# Altium schematic sheet Sheet_1 copy copy.schdoc
size 589 x 414 mm; Device: A_A2; Symbol: A_A2; Name: A_A2; Designator: A; @Project Name: Sheet_1; REV: 1.0; Date: 2023-12-10; Sheet: 1/1; Draw By: sheep_finder; Company: Your Company; Manufacturer Part: ?; Convert to PCB: yes; Add into BOM: yes; Origin Footprint: NONE; Unique ID: frame_lib_1; SheetNumber: 1; SheetTotal: 2
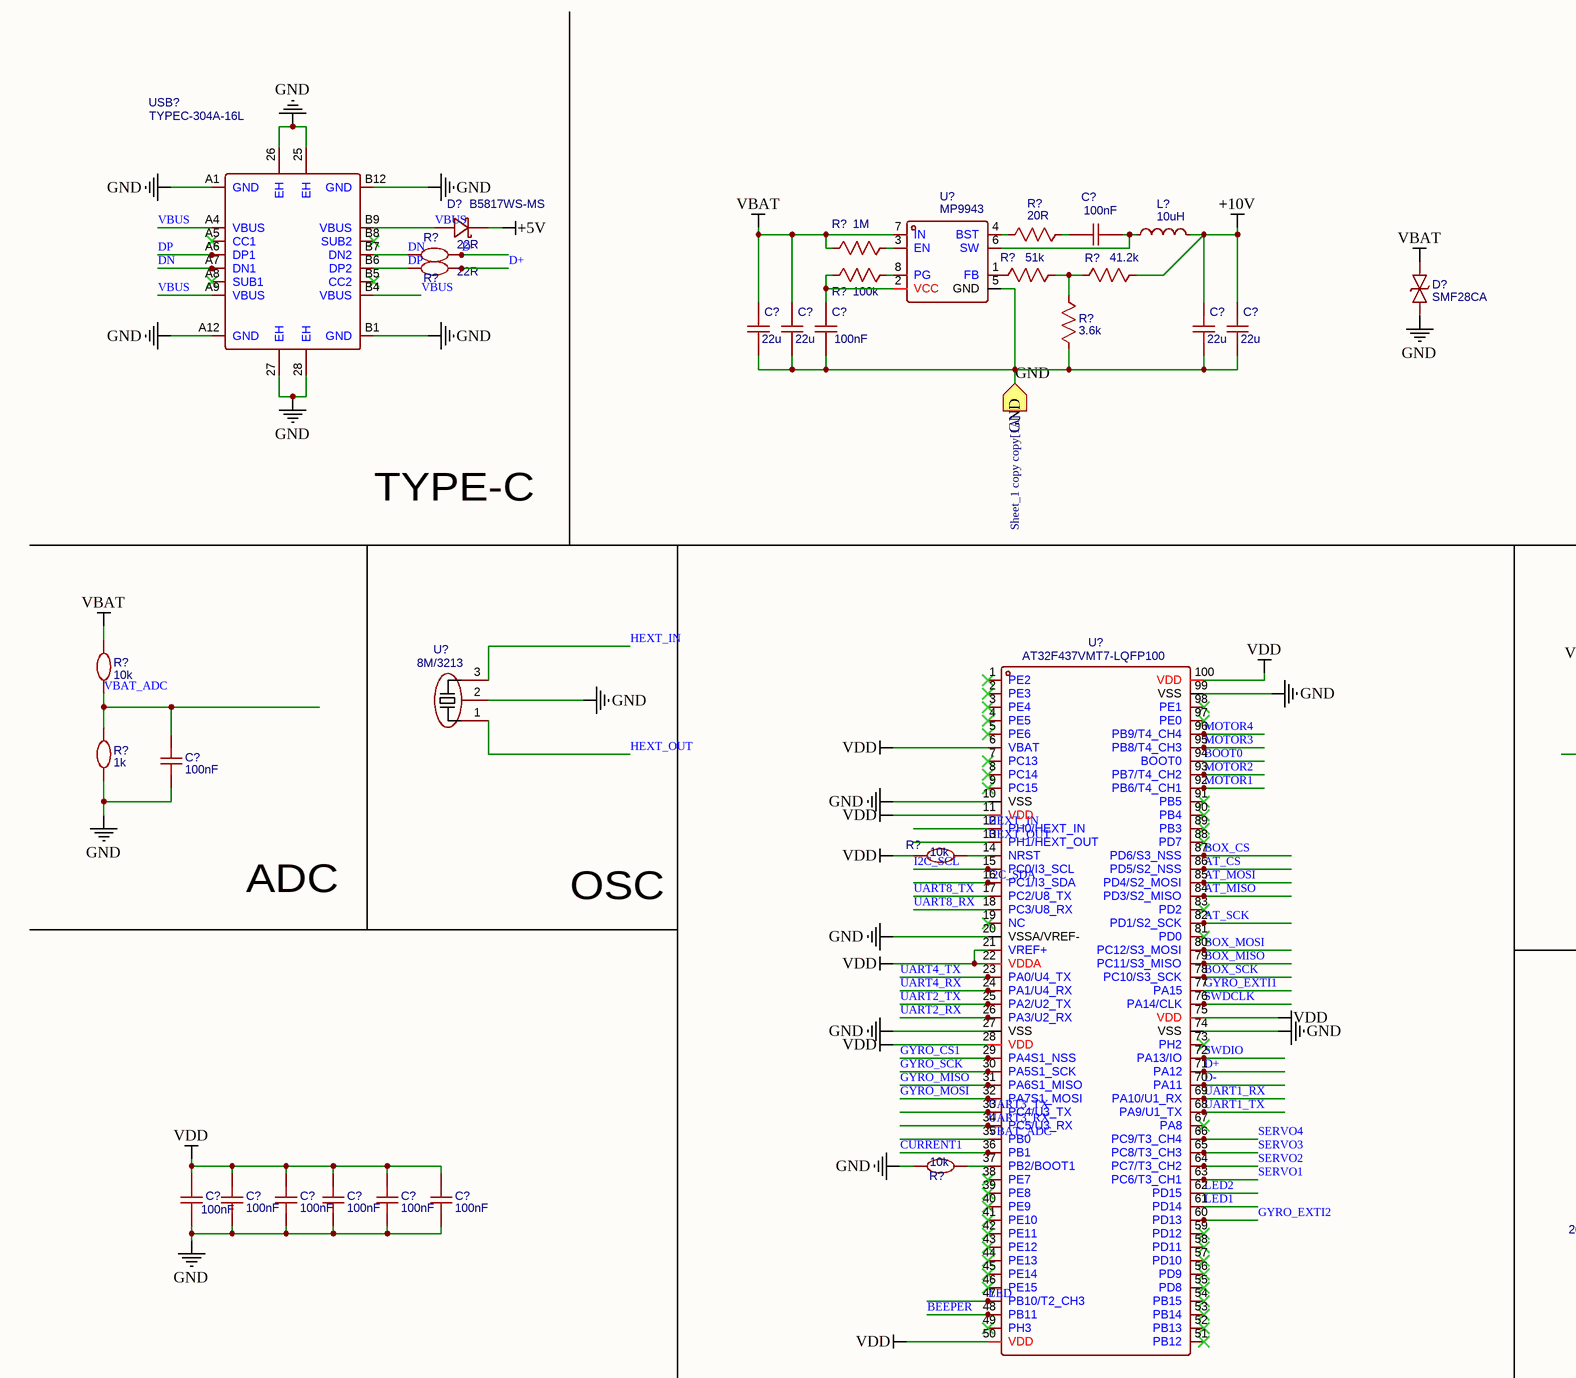
[diagram p0: Sheet_1 copy copy.schdoc, top left]
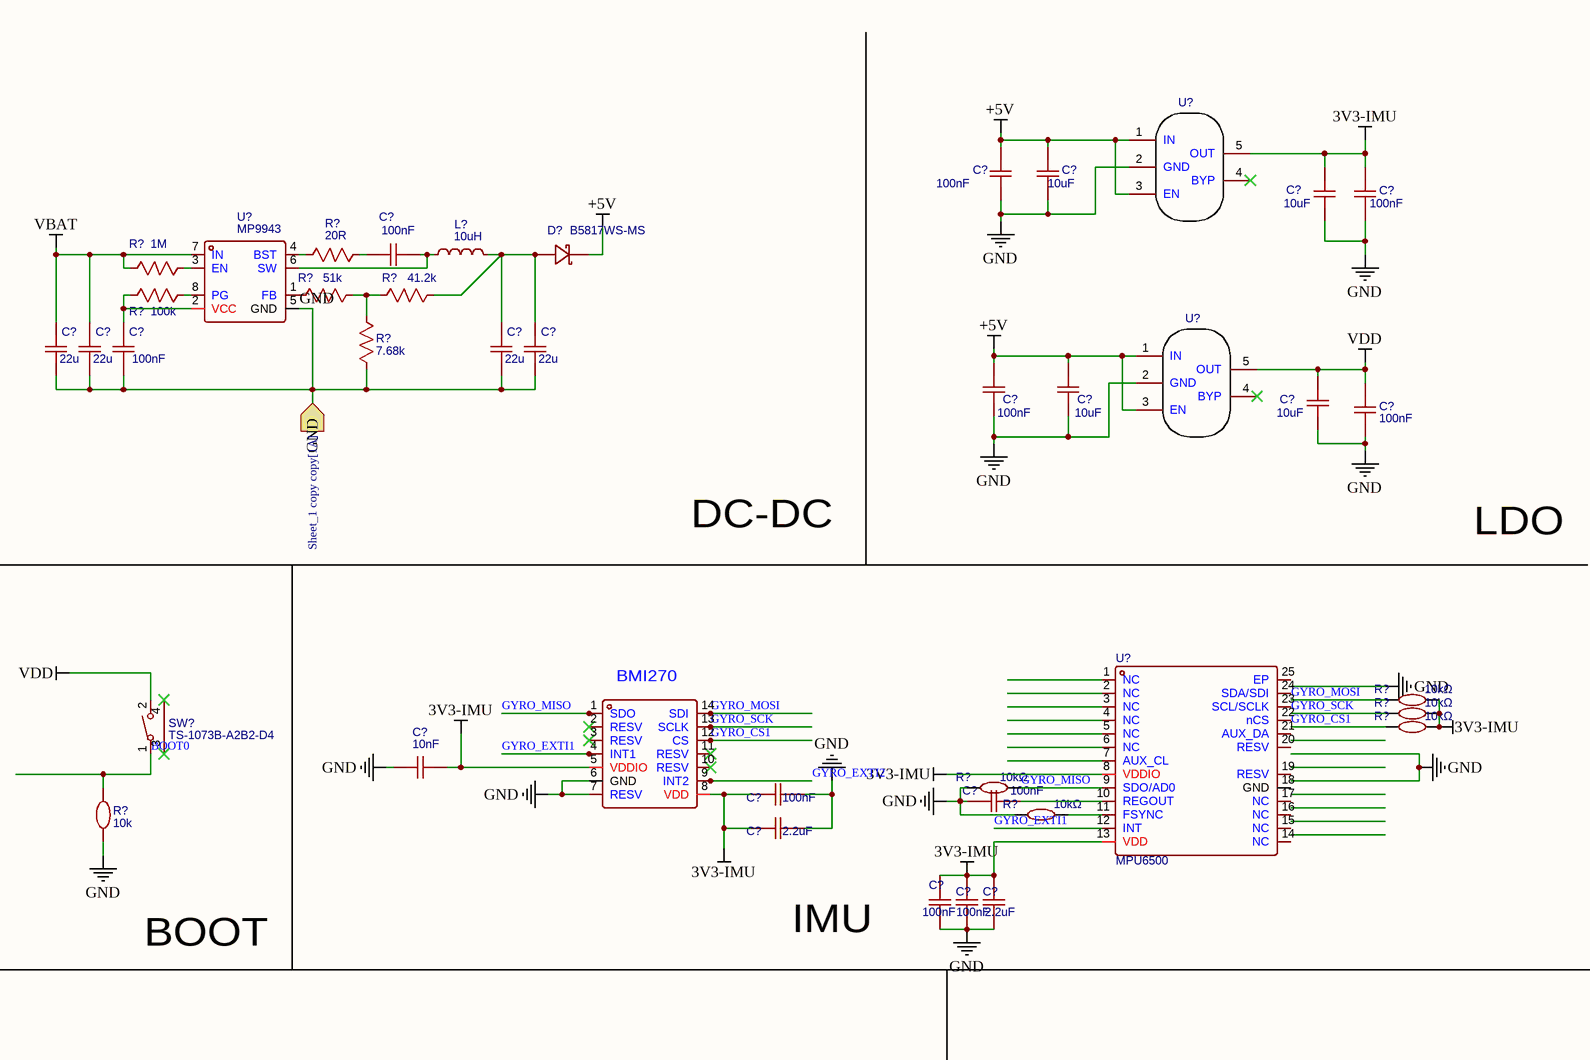
[diagram p1: Sheet_1 copy copy.schdoc, top right]
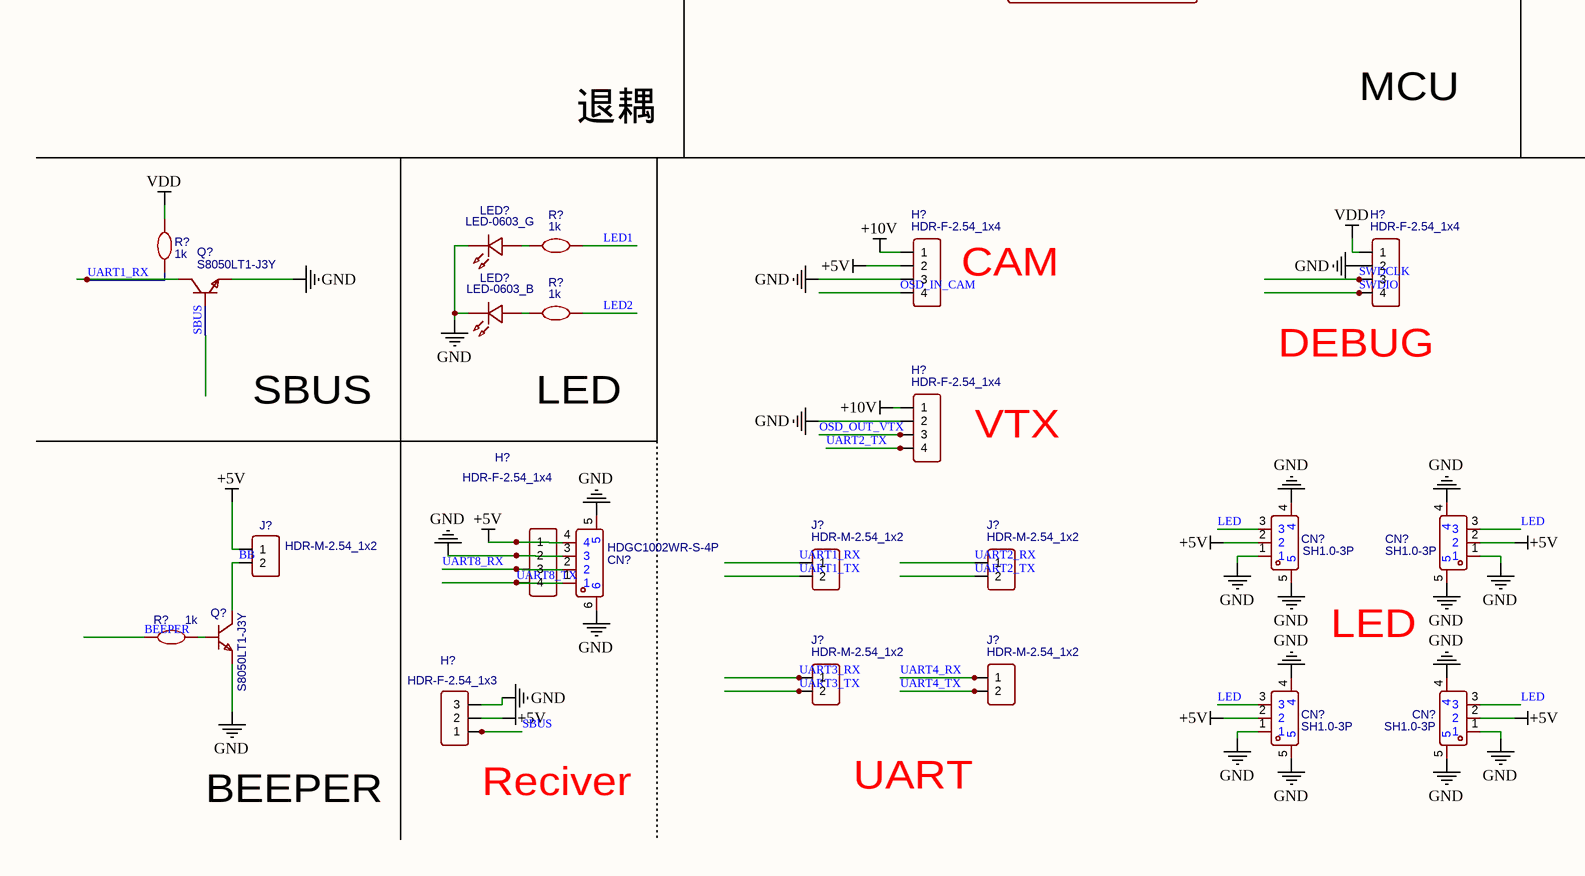
[diagram p2: Sheet_1 copy copy.schdoc, bottom left]
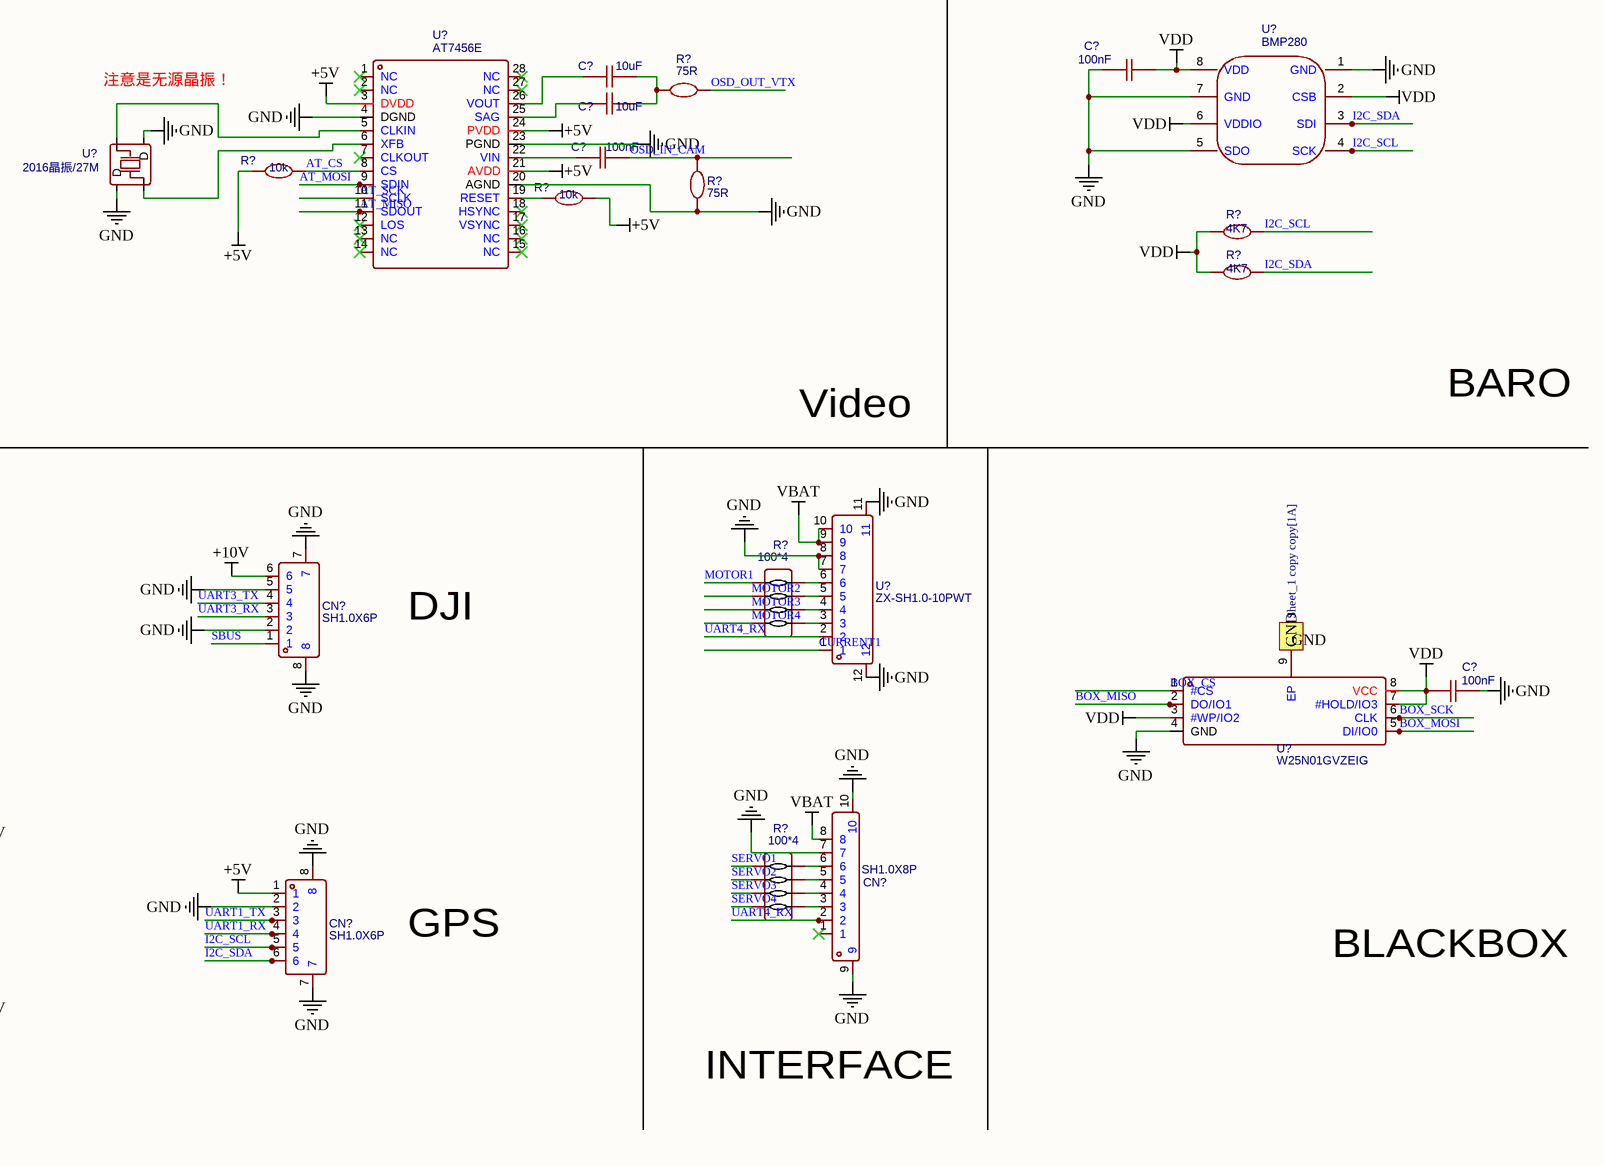
[diagram p3: Sheet_1 copy copy.schdoc, bottom right]

## Parts
(Parts that share a designator on the sheet are numbered #1, #2 ... from top to bottom, then left to right.)
C?#1  100nF  [C0603]
C?#2  10uF  [C0603]
C?#3  10uF  [C0603]
C?#4  100nF  [C0603]
C?#5  100nF  [C0603]
C?#6  100nF  [C0603]
C?#7  22u  [C0805]
C?#8  22u  [C0805]
C?#9  100nF  [C0603]
C?#10  22u  [C0805]
C?#11  22u  [C0805]
C?#12  22u  [C0805]
C?#13  22u  [C0805]
C?#14  100nF  [C0603]
C?#15  22u  [C0805]
C?#16  22u  [C0805]
C?#17  100nF  [C0603]
C?#18  10uF  [C0603]
C?#19  10uF  [C0603]
C?#20  100nF  [C0603]
C?#21  10nF  [C0603]
C?#22  100nF  [C0603]
C?#23  100nF  [C0603]
C?#24  100nF  [C0603]
C?#25  2.2uF  [C0603]
C?#26  100nF  [C0603]
C?#27  100nF  [C0603]
C?#28  2.2uF  [C0603]
C?#29  100nF  [C0603]
C?#30  10uF  [C0603]
C?#31  10uF  [C0603]
C?#32  100nF  [C0603]
C?#33  100nF  [C0603]
C?#34  100nF  [C0603]
C?#35  100nF  [C0603]
C?#36  100nF  [C0603]
C?#37  100nF  [C0603]
C?#38  100nF  [C0603]
C?#39  100nF  [C0603]
CN?#1  SH1.0X6P  [CONN-SMD_6P-P1.00_MEGASTAR_ZX-SH1.0-6PWT]
CN?#2  SH1.0-3P  [CONN-SMD_3P-P1.00_HDGC_HDGC1002WR-S-3P]
CN?#3  SH1.0-3P  [CONN-SMD_3P-P1.00_HDGC_HDGC1002WR-S-3P]
CN?#4  HDGC1002WR-S-4P  [CONN-SMD_4P-P1.00_HDGC_HDGC1002WR-S-4P]
CN?#5  SH1.0X8P  [CONN-SMD_8P-P1.00_WAFER-SH1.0-8PWB]
CN?#6  SH1.0X6P  [CONN-SMD_6P-P1.00_MEGASTAR_ZX-SH1.0-6PWT]
CN?#7  SH1.0-3P  [CONN-SMD_3P-P1.00_HDGC_HDGC1002WR-S-3P]
CN?#8  SH1.0-3P  [CONN-SMD_3P-P1.00_HDGC_HDGC1002WR-S-3P]
D?#1  B5817WS-MS  [SOD-323_L1.7-W1.3-LS2.7-FD]
D?#2  B5817WS-MS  [SOD-323_L1.7-W1.3-LS2.7-FD]
D?#3  SMF28CA  [SOD-123_L2.7-W1.8-LS3.7-BI]
H?#1  HDR-F-2.54_1x4
H?#2  HDR-F-2.54_1x4
H?#3  HDR-F-2.54_1x4
H?#4  HDR-F-2.54_1x4
H?#5  HDR-F-2.54_1x3
J?#1  HDR-M-2.54_1x2
J?#2  HDR-M-2.54_1x2
J?#3  HDR-M-2.54_1x2
J?#4  HDR-M-2.54_1x2
J?#5  HDR-M-2.54_1x2
L?#1  10uH  [IND-SMD_L4.4-W4.0_PHC0420]
L?#2  10uH  [IND-SMD_L4.4-W4.0_PHC0420]
LED?#1  LED-0603_G  [LED0603_GREEN]
LED?#2  LED-0603_B  [LED0603_BLUE]
Q?#1  S8050LT1-J3Y  [SOT-23_L2.9-W1.3-P1.90-LS2.4-BR]
Q?#2  S8050LT1-J3Y  [SOT-23_L2.9-W1.3-P1.90-LS2.4-BR]
R?#1  20R  [R0603]
R?#2  20R  [R0603]
R?#3  1M  [R0603]
R?#4  1M  [R0603]
R?#5  22R  [R0603]
R?#6  22R  [R0603]
R?#7  100k  [R0603]
R?#8  51k  [R0603]
R?#9  41.2k  [R0603]
R?#10  100k  [R0603]
R?#11  51k  [R0603]
R?#12  41.2k  [R0603]
R?#13  3.6k  [R0603]
R?#14  7.68k  [R0603]
R?#15  10k  [R0603]
R?#16  10kΩ  [R0402]
R?#17  10kΩ  [R0402]
R?#18  10kΩ  [R0402]
R?#19  1k  [R0603]
R?#20  10kΩ  [R0402]
R?#21  10k  [R0603]
R?#22  10kΩ  [R0402]
R?#23  10k  [R0603]
R?#24  75R  [R0603]
R?#25  10k  [R0603]
R?#26  10k  [R0603]
R?#27  75R  [R0603]
R?#28  10k  [R0603]
R?#29  4K7  [R0603]
R?#30  4K7  [R0603]
R?#31  1k  [R0603]
R?#32  1k  [R0603]
R?#33  1k  [R0603]
R?#34  100*4  [RES-ARRAY-SMD_0402-8P-L2.0-W1.0-BL]
R?#35  100*4  [RES-ARRAY-SMD_0402-8P-L2.0-W1.0-BL]
R?#36  1k  [R0603]
SDO?  BMI270  [LGA-14_L3.0-W2.5-P0.50-TL]  (value not drawn)
SW?  TS-1073B-A2B2-D4  [KEY-SMD_TS-1073B-A2B2-D4]
U?#1  SPX3819M5-L-3-3/TR  [SOT-23-5_L3.0-W1.7-P0.95-LS2.8-BL]  (value not drawn)
U?#2  MP9943  [QFN-8-3X3]
U?#3  MP9943  [QFN-8-3X3]
U?#4  SPX3819M5-L-3-3/TR  [SOT-23-5_L3.0-W1.7-P0.95-LS2.8-BL]  (value not drawn)
U?#5  8M/3213  [X3213]
U?#6  MPU6500  [QFN-24_L3.0-W3.0-P0.40-BL-EP]
U?#7  AT32F437VMT7-LQFP100  [LQFP-100_L14.0-W14.0-P0.50-LS16.0-TL]
U?#8  BMP280  [SENSOR-TH_BMP280-BL]
U?#9  2016晶振/27M  [2016晶振]
U?#10  AT7456E  [TSSOP-28_L9.7-W4.4-P0.65-LS6.4-BL-EP5.5]
U?#11  ZX-SH1.0-10PWT  [CONN-SMD_10P-P1.00_ZX-SH1.0-10PWT]
U?#12  W25N01GVZEIG  [WSON-8_L8.0-W6.10-P1.27-EP]
USB?  TYPEC-304A-16L  [USB-C-SMD_XUNPU_TYPEC-304A-ACP16L]

## Ports
GND (in, see Sheet_1 copy copy[1A])

## Nets
3V3-IMU: C?#3.2 C?#4.2 C?#21.2 C?#23.2 C?#25.2 C?#26.1 C?#27.1 C?#28.1 R?#16.2 R?#17.2 R?#18.2 SDO?.5(VDDIO) SDO?.8(VDD) U?#1.5(OUT) U?#6.8(VDDIO) U?#6.13(VDD)
+5V: C?#1.2 C?#2.2 C?#17.2 C?#18.2 CN?#2.2 CN?#3.2 CN?#4.4 CN?#6.1 CN?#7.2 CN?#8.2 D?#1.2(K) D?#2.2(K) H?#1.2 H?#4.1 H?#5.2 J?#1.1 R?#26.1 R?#28.2 U?#1.1(IN) U?#1.3(EN) U?#4.1(IN) U?#4.3(EN) U?#10.3(DVDD) U?#10.21(AVDD) U?#10.24(PVDD)
+10V: C?#10.2 C?#11.2 CN?#1.6 H?#1.1 H?#3.1 L?#1.2 R?#9.2
GND: C?#1.1 C?#2.1 C?#3.1 C?#4.1 C?#7.1 C?#8.1 C?#9.1 C?#10.1 C?#11.1 C?#12.1 C?#13.1 C?#14.1 C?#15.1 C?#16.1 C?#17.1 C?#18.1 C?#19.1 C?#20.1 C?#21.1 C?#22.1 C?#23.1 C?#24.1 C?#25.1 C?#26.2 C?#27.2 C?#28.2 C?#29.1 C?#32.1 C?#33.1 C?#34.1 C?#35.1 C?#36.1 C?#37.1 C?#39.2 CN?#1.2 CN?#1.5 CN?#1.7 CN?#1.8 CN?#2.1 CN?#2.4 CN?#2.5 CN?#3.1 CN?#3.4 CN?#3.5 CN?#4.3 CN?#4.5 CN?#4.6 CN?#5.7 CN?#5.9 CN?#5.10 CN?#6.2 CN?#6.7 CN?#6.8 CN?#7.1 CN?#7.4 CN?#7.5 CN?#8.1 CN?#8.4 CN?#8.5 D?#3.2 H?#1.3 H?#2.2 H?#3.2 H?#4.2 H?#5.3 LED?#1.2 LED?#2.2 Q?#1.2 Q?#2.2 R?#13.1 R?#14.1 R?#19.1 R?#20.1 R?#21.2 R?#22.1 R?#25.1 R?#27.1 SDO?.6(GND) SDO?.7(RESV) U?#1.2(GND) U?#2.5(GND) U?#3.5(GND) U?#4.2(GND) U?#5.2 U?#7.10(VSS) U?#7.20(VSSA/VREF-) U?#7.27(VSS) U?#7.74(VSS) U?#7.99(VSS) U?#8.1(GND) U?#8.5(SDO) U?#8.7(GND) U?#9.2(D) U?#9.4(D) U?#10.4(DGND) U?#10.20(AGND) U?#10.23(PGND) U?#11.7 U?#11.8 U?#11.11 U?#11.12 U?#12.4(GND) U?#12.9(EP) USB?.25(EH) USB?.26(EH) USB?.27(EH) USB?.28(EH) USB?.A1(GND) USB?.A12(GND) USB?.B1(GND) USB?.B12(GND) ; port GND
VBAT: C?#7.2 C?#8.2 C?#12.2 C?#13.2 CN?#5.8 D?#3.1 R?#3.2 R?#4.2 R?#15.2 U?#2.7(IN) U?#3.7(IN) U?#11.9 U?#11.10
VDD: C?#19.2 C?#20.2 C?#29.2 C?#32.2 C?#33.2 C?#34.2 C?#35.2 C?#36.2 C?#37.2 C?#39.1 H?#2.1 R?#23.2 R?#29.2 R?#30.2 R?#31.2 SW?.2 U?#4.5(OUT) U?#7.6(VBAT) U?#7.11(VDD) U?#7.21(VREF+) U?#7.22(VDDA) U?#7.28(VDD) U?#7.50(VDD) U?#7.75(VDD) U?#7.100(VDD) U?#8.2(CSB) U?#8.6(VDDIO) U?#8.8(VDD) U?#12.3(#WP/IO2) U?#12.7(#HOLD/IO3) U?#12.8(VCC)
AT_CS: R?#26.2 U?#7.86(PD5/S2_NSS) U?#10.8(CS)
AT_MISO: U?#7.84(PD3/S2_MISO) U?#10.11(SDOUT)
AT_MOSI: U?#7.85(PD4/S2_MOSI) U?#10.9(SDIN)
AT_SCK: U?#7.82(PD1/S2_SCK) U?#10.10(SCLK)
BB: J?#1.2 Q?#2.3
BEEPER: R?#36.1 U?#7.48(PB11)
BOOT0: R?#21.1 SW?.1 U?#7.94(BOOT0)
BOX_CS: U?#7.87(PD6/S3_NSS) U?#12.1(#CS)
BOX_MISO: U?#7.79(PC11/S3_MISO) U?#12.2(DO/IO1)
BOX_MOSI: U?#7.80(PC12/S3_MOSI) U?#12.5(DI/IO0)
BOX_SCK: U?#7.78(PC10/S3_SCK) U?#12.6(CLK)
CURRENT1: U?#7.36(PB1) U?#11.1
D+: R?#6.2 U?#7.71(PA12)
D-: R?#5.2 U?#7.70(PA11)
DN: R?#5.1 USB?.A7(DN1) USB?.B7(DN2)
DP: R?#6.1 USB?.A6(DP1) USB?.B6(DP2)
GYRO_CS1: R?#18.1 SDO?.12(CS) U?#7.29(PA4S1_NSS)
GYRO_EXTI1: SDO?.4(INT1) U?#6.12(INT) U?#7.77(PA15)
GYRO_EXTI2: SDO?.9(INT2) U?#7.60(PD13)
GYRO_MISO: R?#20.2 SDO?.1(SDO) U?#6.9(SDO/AD0) U?#7.31(PA6S1_MISO)
GYRO_MOSI: R?#16.1 SDO?.14(SDI) U?#7.32(PA7S1_MOSI)
GYRO_SCK: R?#17.1 SDO?.13(SCLK) U?#7.30(PA5S1_SCK)
HEXT_IN: U?#5.3 U?#7.12(PH0/HEXT_IN)
HEXT_OUT: U?#5.1 U?#7.13(PH1/HEXT_OUT)
I2C_SCL: CN?#6.5 R?#29.1 U?#7.15(PC0/I3_SCL) U?#8.4(SCK)
I2C_SDA: CN?#6.6 R?#30.1 U?#7.16(PC1/I3_SDA) U?#8.3(SDI)
LED: CN?#2.3 CN?#3.3 CN?#7.3 CN?#8.3 U?#7.47(PB10/T2_CH3)
LED1: R?#32.2 U?#7.61(PD14)
LED2: R?#33.2 U?#7.62(PD15)
MOTOR1: R?#34.4 U?#7.92(PB6/T4_CH1)
MOTOR2: R?#34.3 U?#7.93(PB7/T4_CH2)
MOTOR3: R?#34.2 U?#7.95(PB8/T4_CH3)
MOTOR4: R?#34.1 U?#7.96(PB9/T4_CH4)
OSD_IN_CAM: C?#38.2 H?#1.4 R?#27.2
OSD_OUT_VTX: H?#3.3 R?#24.2
SBUS: CN?#1.1 H?#5.1 Q?#1.1
SERVO1: R?#35.4 U?#7.63(PC6/T3_CH1)
SERVO2: R?#35.3 U?#7.64(PC7/T3_CH2)
SERVO3: R?#35.2 U?#7.65(PC8/T3_CH3)
SERVO4: R?#35.1 U?#7.66(PC9/T3_CH4)
SWDCLK: H?#2.3 U?#7.76(PA14/CLK)
SWDIO: H?#2.4 U?#7.72(PA13/IO)
UART1_RX: CN?#6.4 J?#2.1 Q?#1.3 R?#31.1 U?#7.69(PA10/U1_RX)
UART1_TX: CN?#6.3 J?#2.2 U?#7.68(PA9/U1_TX)
UART2_RX: J?#3.1 U?#7.26(PA3/U2_RX)
UART2_TX: H?#3.4 J?#3.2 U?#7.25(PA2/U2_TX)
UART3_RX: CN?#1.3 J?#4.1 U?#7.34(PC5/U3_RX)
UART3_TX: CN?#1.4 J?#4.2 U?#7.33(PC4/U3_TX)
UART4_RX: CN?#5.2 J?#5.1 U?#7.24(PA1/U4_RX) U?#11.2
UART4_TX: J?#5.2 U?#7.23(PA0/U4_TX)
UART8_RX: CN?#4.2 H?#4.3 U?#7.18(PC3/U8_RX)
UART8_TX: CN?#4.1 H?#4.4 U?#7.17(PC2/U8_TX)
VBAT_ADC: C?#22.2 R?#15.1 R?#19.2 U?#7.35(PB0)
VBUS: D?#1.1(A) USB?.A4(VBUS) USB?.A9(VBUS) USB?.B4(VBUS) USB?.B9(VBUS)
NetC?#5_1: C?#5.1 R?#1.2
NetC?#5_2: C?#5.2 L?#1.1 U?#2.6(SW)
NetC?#6_1: C?#6.1 R?#2.2
NetC?#6_2: C?#6.2 L?#2.1 U?#3.6(SW)
NetC?#9_2: C?#9.2 R?#7.1 U?#2.2(VCC)
NetC?#14_2: C?#14.2 R?#10.1 U?#3.2(VCC)
NetC?#15_2: C?#15.2 C?#16.2 D?#2.1(A) L?#2.2 R?#12.2
NetC?#24_2: C?#24.2 U?#6.10(REGOUT)
NetC?#30_1: C?#30.1 C?#31.1 R?#24.1
NetC?#30_2: C?#30.2 U?#10.26(VOUT)
NetC?#31_2: C?#31.2 U?#10.25(SAG)
NetC?#38_1: C?#38.1 U?#10.22(VIN)
NetCN?#5_3: CN?#5.3 R?#35.8
NetCN?#5_4: CN?#5.4 R?#35.7
NetCN?#5_5: CN?#5.5 R?#35.6
NetCN?#5_6: CN?#5.6 R?#35.5
NetLED?#1_1: LED?#1.1 R?#32.1
NetLED?#2_1: LED?#2.1 R?#33.1
NetQ?#2_1: Q?#2.1 R?#36.2
NetR?#1_1: R?#1.1 U?#2.4(BST)
NetR?#2_1: R?#2.1 U?#3.4(BST)
NetR?#3_1: R?#3.1 U?#2.3(EN)
NetR?#4_1: R?#4.1 U?#3.3(EN)
NetR?#7_2: R?#7.2 U?#2.8(PG)
NetR?#8_1: R?#8.1 U?#2.1(FB)
NetR?#8_2: R?#8.2 R?#9.1 R?#13.2
NetR?#10_2: R?#10.2 U?#3.8(PG)
NetR?#11_1: R?#11.1 U?#3.1(FB)
NetR?#11_2: R?#11.2 R?#12.1 R?#14.2
NetR?#22_2: R?#22.2 U?#6.11(FSYNC)
NetR?#23_1: R?#23.1 U?#7.14(NRST)
NetR?#25_2: R?#25.2 U?#7.37(PB2/BOOT1)
NetR?#28_1: R?#28.1 U?#10.19(RESET)
NetR?#34_5: R?#34.5 U?#11.6
NetR?#34_6: R?#34.6 U?#11.5
NetR?#34_7: R?#34.7 U?#11.4
NetR?#34_8: R?#34.8 U?#11.3
NetU?#9_1: U?#9.1(OSC1) U?#10.5(CLKIN)
NetU?#9_3: U?#9.3(OSC2) U?#10.6(XFB)

Not connected (* = marked no-connect by the designer): CN?#5 1*; SDO? 2(RESV)* 3(RESV)* 10(RESV)* 11(RESV)*; SW? 3* 4*; U?#1 4(BYP)*; U?#4 4(BYP)*; U?#6 1(NC) 2(NC) 3(NC) 4(NC) 5(NC) 6(NC) 7(AUX_CL) 14(NC) 15(NC) 16(NC) 17(NC) 18(GND) 19(RESV) 20(RESV) 21(AUX_DA) 22(nCS) 23(SCL/SCLK) 24(SDA/SDI) 25(EP); U?#7 1(PE2)* 2(PE3)* 3(PE4)* 4(PE5)* 5(PE6)* 7(PC13)* 8(PC14)* 9(PC15)* 19(NC)* 38(PE7)* 39(PE8)* 40(PE9)* 41(PE10)* 42(PE11)* 43(PE12)* 44(PE13)* 45(PE14)* 46(PE15)* 49(PH3)* 51(PB12)* 52(PB13)* 53(PB14)* 54(PB15)* 55(PD8)* 56(PD9)* 57(PD10)* 58(PD11)* 59(PD12)* 67(PA8)* 73(PH2)* 81(PD0)* 83(PD2)* 88(PD7)* 89(PB3)* 90(PB4)* 91(PB5)* 97(PE0)* 98(PE1)*; U?#10 1(NC)* 2(NC)* 7(CLKOUT)* 12(LOS)* 13(NC)* 14(NC)* 15(NC)* 16(NC)* 17(VSYNC)* 18(HSYNC)* 27(NC)* 28(NC)*; USB? A5(CC1)* A8(SUB1)* B5(CC2)* B8(SUB2)*

## Notes on the sheet
- TYPE-C
- DC-DC
- LDO
- (near SDO?) BMI270
- ADC
- OSC
- BOOT
- IMU
- 注意是无源晶振！
- 退耦
- MCU
- Video
- BARO
- (near H?#1) CAM
- DJI
- SBUS
- LED
- (near H?#2) DEBUG
- VTX
- (near CN?#2) LED
- GPS
- BLACKBOX
- BEEPER
- (near H?#5) Reciver
- UART
- INTERFACE
- 1
- 2
- 3
- 4
- 5
- 6
- 7
- 8
- 9
- 10
- 11
- A
- B
- C
- D
- E
- F
- G
- H
- TITLE:
- Sheet_1
- Company:
- Your Company
- Sheet:
- REV:
- 1.0
- 1/1
- Date:
- 2023-12-10
- Drawn By:
- sheep_finder

## Library data of the parts
C?#1 = 100nF: Convert to PCB: yes; UniqueId: ggeca7b0ddeeb75bee7; OriginModelName: C0603_L1.6-W0.8-H0.8; ModelTransform: 62.992,31.496,0,0,0,0,0,0,0; Device: 100nF; Add into BOM: yes; SymbolName: 100nF; FootprintName: C0603
C?#2 = 10uF: Convert to PCB: yes; UniqueId: gge5965a6e0a8e1c0df; OriginModelName: C0603_L1.6-W0.8-H0.8; ModelTransform: 62.992,31.496,0,0,0,0,0,0,0; Device: 10uF; Add into BOM: yes; SymbolName: 10uF; FootprintName: C0603
C?#3 = 10uF: Convert to PCB: yes; UniqueId: ggee7971eff1ce66244; OriginModelName: C0603_L1.6-W0.8-H0.8; ModelTransform: 62.992,31.496,0,0,0,0,0,0,0; Device: 10uF; Add into BOM: yes; SymbolName: 10uF; FootprintName: C0603
C?#4 = 100nF: Convert to PCB: yes; UniqueId: gge7ba523bb7e9eb41d; OriginModelName: C0603_L1.6-W0.8-H0.8; ModelTransform: 62.992,31.496,0,0,0,0,0,0,0; Device: 100nF; Add into BOM: yes; SymbolName: 100nF; FootprintName: C0603
C?#5 = 100nF: Convert to PCB: yes; UniqueId: gge52ce95ff5addf7c7; OriginModelName: C0603_L1.6-W0.8-H0.8; ModelTransform: 62.992,31.496,0,0,0,0,0,0,0; Device: 100nF; Add into BOM: yes; SymbolName: 100nF; FootprintName: C0603
C?#6 = 100nF: Convert to PCB: yes; UniqueId: ggecda314712177e332; OriginModelName: C0603_L1.6-W0.8-H0.8; ModelTransform: 62.992,31.496,0,0,0,0,0,0,0; Device: 100nF; Add into BOM: yes; SymbolName: 100nF; FootprintName: C0603
C?#7 = 22u: Convert to PCB: yes; UniqueId: gge353fd94c7c744818; OriginModelName: C0805_L2.0-W1.3-H1.3; ModelTransform: 78.74,51.181,0,0,0,0,0,0,0; Device: 22u; Add into BOM: yes; SymbolName: 22u; FootprintName: C0805
C?#8 = 22u: Convert to PCB: yes; UniqueId: gge3f3579b26317b48f; OriginModelName: C0805_L2.0-W1.3-H1.3; ModelTransform: 78.74,51.181,0,0,0,0,0,0,0; Device: 22u; Add into BOM: yes; SymbolName: 22u; FootprintName: C0805
C?#9 = 100nF: Convert to PCB: yes; UniqueId: gge6703928f547b0b14; OriginModelName: C0603_L1.6-W0.8-H0.8; ModelTransform: 62.992,31.496,0,0,0,0,0,0,0; Device: 100nF; Add into BOM: yes; SymbolName: 100nF; FootprintName: C0603
C?#10 = 22u: Convert to PCB: yes; UniqueId: ggea3c3f9500a281c6b; OriginModelName: C0805_L2.0-W1.3-H1.3; ModelTransform: 78.74,51.181,0,0,0,0,0,0,0; Device: 22u; Add into BOM: yes; SymbolName: 22u; FootprintName: C0805
C?#11 = 22u: Convert to PCB: yes; UniqueId: gge2484e21a77e28d03; OriginModelName: C0805_L2.0-W1.3-H1.3; ModelTransform: 78.74,51.181,0,0,0,0,0,0,0; Device: 22u; Add into BOM: yes; SymbolName: 22u; FootprintName: C0805
C?#12 = 22u: Convert to PCB: yes; UniqueId: gge7b8deaa52abeee98; OriginModelName: C0805_L2.0-W1.3-H1.3; ModelTransform: 78.74,51.181,0,0,0,0,0,0,0; Device: 22u; Add into BOM: yes; SymbolName: 22u; FootprintName: C0805
C?#13 = 22u: Convert to PCB: yes; UniqueId: gge0c0d9a2245dd9bee; OriginModelName: C0805_L2.0-W1.3-H1.3; ModelTransform: 78.74,51.181,0,0,0,0,0,0,0; Device: 22u; Add into BOM: yes; SymbolName: 22u; FootprintName: C0805
C?#14 = 100nF: Convert to PCB: yes; UniqueId: ggeb64b90ee87dd39cb; OriginModelName: C0603_L1.6-W0.8-H0.8; ModelTransform: 62.992,31.496,0,0,0,0,0,0,0; Device: 100nF; Add into BOM: yes; SymbolName: 100nF; FootprintName: C0603
C?#15 = 22u: Convert to PCB: yes; UniqueId: gge32340f00fe0e8bd0; OriginModelName: C0805_L2.0-W1.3-H1.3; ModelTransform: 78.74,51.181,0,0,0,0,0,0,0; Device: 22u; Add into BOM: yes; SymbolName: 22u; FootprintName: C0805
C?#16 = 22u: Convert to PCB: yes; UniqueId: ggee6eb9f67a65547cc; OriginModelName: C0805_L2.0-W1.3-H1.3; ModelTransform: 78.74,51.181,0,0,0,0,0,0,0; Device: 22u; Add into BOM: yes; SymbolName: 22u; FootprintName: C0805
C?#17 = 100nF: Convert to PCB: yes; UniqueId: ggea85fba6b31ef2400; OriginModelName: C0603_L1.6-W0.8-H0.8; ModelTransform: 62.992,31.496,0,0,0,0,0,0,0; Device: 100nF; Add into BOM: yes; SymbolName: 100nF; FootprintName: C0603
C?#18 = 10uF: Convert to PCB: yes; UniqueId: gge4c0cbcdc33413a46; OriginModelName: C0603_L1.6-W0.8-H0.8; ModelTransform: 62.992,31.496,0,0,0,0,0,0,0; Device: 10uF; Add into BOM: yes; SymbolName: 10uF; FootprintName: C0603
C?#19 = 10uF: Convert to PCB: yes; UniqueId: gge6e9699387ec808ae; OriginModelName: C0603_L1.6-W0.8-H0.8; ModelTransform: 62.992,31.496,0,0,0,0,0,0,0; Device: 10uF; Add into BOM: yes; SymbolName: 10uF; FootprintName: C0603
C?#20 = 100nF: Convert to PCB: yes; UniqueId: ggedb2a942aedfaf0e5; OriginModelName: C0603_L1.6-W0.8-H0.8; ModelTransform: 62.992,31.496,0,0,0,0,0,0,0; Device: 100nF; Add into BOM: yes; SymbolName: 100nF; FootprintName: C0603
C?#21 = 10nF: Convert to PCB: yes; UniqueId: ggecba86c4f4db73d07; OriginModelName: C0603_L1.6-W0.8-H0.8; ModelTransform: 62.992,31.496,0,0,0,0,0,0,0; Device: 10nF; Add into BOM: yes; SymbolName: 10nF; FootprintName: C0603
C?#22 = 100nF: Convert to PCB: yes; UniqueId: gged673bfa93339740f; OriginModelName: C0603_L1.6-W0.8-H0.8; ModelTransform: 62.992,31.496,0,0,0,0,0,0,0; Device: 100nF; Add into BOM: yes; SymbolName: 100nF; FootprintName: C0603
C?#23 = 100nF: Convert to PCB: yes; UniqueId: gge03e79812ca9f1594; OriginModelName: C0603_L1.6-W0.8-H0.8; ModelTransform: 62.992,31.496,0,0,0,0,0,0,0; Device: 100nF; Add into BOM: yes; SymbolName: 100nF; FootprintName: C0603
C?#24 = 100nF: Convert to PCB: yes; UniqueId: gge2b0adef4c2000f72; OriginModelName: C0603_L1.6-W0.8-H0.8; ModelTransform: 62.992,31.496,0,0,0,0,0,0,0; Device: 100nF; Add into BOM: yes; SymbolName: 100nF; FootprintName: C0603
C?#25 = 2.2uF: Convert to PCB: yes; UniqueId: gge194ad5a5974422c7; OriginModelName: C0603_L1.6-W0.8-H0.8; ModelTransform: 62.992,31.496,0,0,0,0,0,0,0; Device: 2.2uF; Add into BOM: yes; SymbolName: 2.2uF; FootprintName: C0603
C?#26 = 100nF: Convert to PCB: yes; UniqueId: gge1844c11426338be2; OriginModelName: C0603_L1.6-W0.8-H0.8; ModelTransform: 62.992,31.496,0,0,0,0,0,0,0; Device: 100nF; Add into BOM: yes; SymbolName: 100nF; FootprintName: C0603
C?#27 = 100nF: Convert to PCB: yes; UniqueId: ggefc1b89ea0528c883; OriginModelName: C0603_L1.6-W0.8-H0.8; ModelTransform: 62.992,31.496,0,0,0,0,0,0,0; Device: 100nF; Add into BOM: yes; SymbolName: 100nF; FootprintName: C0603
C?#28 = 2.2uF: Convert to PCB: yes; UniqueId: gge6b0287d4c016d85a; OriginModelName: C0603_L1.6-W0.8-H0.8; ModelTransform: 62.992,31.496,0,0,0,0,0,0,0; Device: 2.2uF; Add into BOM: yes; SymbolName: 2.2uF; FootprintName: C0603
C?#29 = 100nF: Convert to PCB: yes; UniqueId: ggec38fa6919078953f; OriginModelName: C0603_L1.6-W0.8-H0.8; ModelTransform: 62.992,31.496,0,0,0,0,0,0,0; Device: 100nF; Add into BOM: yes; SymbolName: 100nF; FootprintName: C0603
C?#30 = 10uF: Convert to PCB: yes; UniqueId: ggeeb9301ced7e232ca; OriginModelName: C0603_L1.6-W0.8-H0.8; ModelTransform: 62.992,31.496,0,0,0,0,0,0,0; Device: 10uF; Add into BOM: yes; SymbolName: 10uF; FootprintName: C0603
C?#31 = 10uF: Convert to PCB: yes; UniqueId: gge9a113f5a677df9d8; OriginModelName: C0603_L1.6-W0.8-H0.8; ModelTransform: 62.992,31.496,0,0,0,0,0,0,0; Device: 10uF; Add into BOM: yes; SymbolName: 10uF; FootprintName: C0603
C?#32 = 100nF: Convert to PCB: yes; UniqueId: ggef40206292685441e; OriginModelName: C0603_L1.6-W0.8-H0.8; ModelTransform: 62.992,31.496,0,0,0,0,0,0,0; Device: 100nF; Add into BOM: yes; SymbolName: 100nF; FootprintName: C0603
C?#33 = 100nF: Convert to PCB: yes; UniqueId: gge2ebcfc57574d399a; OriginModelName: C0603_L1.6-W0.8-H0.8; ModelTransform: 62.992,31.496,0,0,0,0,0,0,0; Device: 100nF; Add into BOM: yes; SymbolName: 100nF; FootprintName: C0603
C?#34 = 100nF: Convert to PCB: yes; UniqueId: gged33014bcecda883b; OriginModelName: C0603_L1.6-W0.8-H0.8; ModelTransform: 62.992,31.496,0,0,0,0,0,0,0; Device: 100nF; Add into BOM: yes; SymbolName: 100nF; FootprintName: C0603
C?#35 = 100nF: Convert to PCB: yes; UniqueId: ggee2bd2f168eb7a19f; OriginModelName: C0603_L1.6-W0.8-H0.8; ModelTransform: 62.992,31.496,0,0,0,0,0,0,0; Device: 100nF; Add into BOM: yes; SymbolName: 100nF; FootprintName: C0603
C?#36 = 100nF: Convert to PCB: yes; UniqueId: ggedee51cfaf3930afd; OriginModelName: C0603_L1.6-W0.8-H0.8; ModelTransform: 62.992,31.496,0,0,0,0,0,0,0; Device: 100nF; Add into BOM: yes; SymbolName: 100nF; FootprintName: C0603
C?#37 = 100nF: Convert to PCB: yes; UniqueId: gge26811f5395af21ce; OriginModelName: C0603_L1.6-W0.8-H0.8; ModelTransform: 62.992,31.496,0,0,0,0,0,0,0; Device: 100nF; Add into BOM: yes; SymbolName: 100nF; FootprintName: C0603
C?#38 = 100nF: Convert to PCB: yes; UniqueId: gge8daa5e5140b19545; OriginModelName: C0603_L1.6-W0.8-H0.8; ModelTransform: 62.992,31.496,0,0,0,0,0,0,0; Device: 100nF; Add into BOM: yes; SymbolName: 100nF; FootprintName: C0603
C?#39 = 100nF: Convert to PCB: yes; UniqueId: gge108316898df37a9f; OriginModelName: C0603_L1.6-W0.8-H0.8; ModelTransform: 62.992,31.496,0,0,0,0,0,0,0; Device: 100nF; Add into BOM: yes; SymbolName: 100nF; FootprintName: C0603
CN?#1 = ZX-SH1.0-6PWT: Manufacturer: Megastar(兆星); Convert to PCB: yes; UniqueId: ggecd9d3fcf4734ba22; ModelTransform: 329.1332,198.8185,0,0,0,0,0.002,-7.876,0; Device: ZX-SH1.0-6PWT; Supplier: LCSC; Supplier Part: C7430448; Manufacturer Part: ZX-SH1.0-6PWT; JLCPCB Part Class: Extended Part; link: https://so.szlcsc.com/global.html?k=C7430448&ref=editor; Add into BOM: yes; SymbolName: SH1.0X6P; FootprintName: CONN-SMD_6P-P1.00_MEGASTAR_ZX-SH1.0-6PWT; OriginModelName: CONN-SMD_6P-P1.00_MEGASTAR_ZX-SH1.0-6PWT
CN?#2 = HDGC1002WR-S-3P: Manufacturer: HDGC(华德共创); Convert to PCB: yes; UniqueId: ggec0020a35e89ad4ff; ModelTransform: 210.63,196.85,0,0,0,0,0,-9.565,0; Device: HDGC1002WR-S-3P; Supplier: LCSC; Supplier Part: C2936213; Manufacturer Part: HDGC1002WR-S-3P; JLCPCB Part Class: Extended Part; Add into BOM: yes; SymbolName: SH1.0-3P; FootprintName: CONN-SMD_3P-P1.00_HDGC_HDGC1002WR-S-3P; OriginModelName: CONN-SMD_3P-P1.00_HDGC_HDGC1002WR-S-3P
CN?#3 = HDGC1002WR-S-3P: Manufacturer: HDGC(华德共创); Convert to PCB: yes; UniqueId: gge2ce44b7eaad9832b; ModelTransform: 210.63,196.85,0,0,0,0,0,-9.565,0; Device: HDGC1002WR-S-3P; Supplier: LCSC; Supplier Part: C2936213; Manufacturer Part: HDGC1002WR-S-3P; JLCPCB Part Class: Extended Part; Add into BOM: yes; SymbolName: SH1.0-3P; FootprintName: CONN-SMD_3P-P1.00_HDGC_HDGC1002WR-S-3P; OriginModelName: CONN-SMD_3P-P1.00_HDGC_HDGC1002WR-S-3P
CN?#4 = HDGC1002WR-S-4P: Manufacturer: HDGC(华德共创); Convert to PCB: yes; UniqueId: ggee5a51ee7bd50bb1d; ModelTransform: 249.9995,196.85,0,0,0,0,0,-5.906,0; Device: HDGC1002WR-S-4P; Supplier: LCSC; Supplier Part: C2936214; Manufacturer Part: HDGC1002WR-S-4P; JLCPCB Part Class: Extended Part; Add into BOM: yes; SymbolName: HDGC1002WR-S-4P; FootprintName: CONN-SMD_4P-P1.00_HDGC_HDGC1002WR-S-4P; OriginModelName: CONN-SMD_4P-P1.00_HDGC_HDGC1002WR-S-4P
CN?#5 = WAFER_SMT_1.0X8: Manufacturer: null; Convert to PCB: yes; UniqueId: ggebe725300a9fc9f2b; ModelTransform: 407.873,198.8185,0,0,0,0,-0.001,-16.732,0; Device: WAFER_SMT_1.0X8; Supplier: LCSC; Supplier Part: C9900021939; Manufacturer Part: WAFER_SMT_1.0X8; JLCPCB Part Class: Extended Part; Add into BOM: yes; SymbolName: SH1.0X8P; FootprintName: CONN-SMD_8P-P1.00_WAFER-SH1.0-8PWB; OriginModelName: CONN-SMD_8P-P1.00_WAFER-SH1.0-8PWB
CN?#6 = ZX-SH1.0-6PWT: Manufacturer: Megastar(兆星); Convert to PCB: yes; UniqueId: gge7f46dd2bd5c42fec; ModelTransform: 329.1332,198.8185,0,0,0,0,0.002,-7.876,0; Device: ZX-SH1.0-6PWT; Supplier: LCSC; Supplier Part: C7430448; Manufacturer Part: ZX-SH1.0-6PWT; JLCPCB Part Class: Extended Part; link: https://so.szlcsc.com/global.html?k=C7430448&ref=editor; Add into BOM: yes; SymbolName: SH1.0X6P; FootprintName: CONN-SMD_6P-P1.00_MEGASTAR_ZX-SH1.0-6PWT; OriginModelName: CONN-SMD_6P-P1.00_MEGASTAR_ZX-SH1.0-6PWT
CN?#7 = HDGC1002WR-S-3P: Manufacturer: HDGC(华德共创); Convert to PCB: yes; UniqueId: gge5e0003f38aa131f5; ModelTransform: 210.63,196.85,0,0,0,0,0,-9.565,0; Device: HDGC1002WR-S-3P; Supplier: LCSC; Supplier Part: C2936213; Manufacturer Part: HDGC1002WR-S-3P; JLCPCB Part Class: Extended Part; Add into BOM: yes; SymbolName: SH1.0-3P; FootprintName: CONN-SMD_3P-P1.00_HDGC_HDGC1002WR-S-3P; OriginModelName: CONN-SMD_3P-P1.00_HDGC_HDGC1002WR-S-3P
CN?#8 = HDGC1002WR-S-3P: Manufacturer: HDGC(华德共创); Convert to PCB: yes; UniqueId: ggecca6adc977efc5d6; ModelTransform: 210.63,196.85,0,0,0,0,0,-9.565,0; Device: HDGC1002WR-S-3P; Supplier: LCSC; Supplier Part: C2936213; Manufacturer Part: HDGC1002WR-S-3P; JLCPCB Part Class: Extended Part; Add into BOM: yes; SymbolName: SH1.0-3P; FootprintName: CONN-SMD_3P-P1.00_HDGC_HDGC1002WR-S-3P; OriginModelName: CONN-SMD_3P-P1.00_HDGC_HDGC1002WR-S-3P
D?#1 = B5817WS-MS: Manufacturer: MSKSEMI(美森科); Convert to PCB: yes; UniqueId: gge7bf08ecfc7523faa; ModelTransform: 104.3305,51.181,0,0,0,0,0,0,0; Device: B5817WS-MS; Supplier: LCSC; Supplier Part: C2836388; Manufacturer Part: B5817WS-MS; JLCPCB Part Class: Extended Part; Add into BOM: yes; SymbolName: B5817WS-MS; FootprintName: SOD-323_L1.7-W1.3-LS2.7-FD; OriginModelName: SOD-323_L1.7-W1.3-LS2.7-FD
D?#2 = B5817WS-MS: Manufacturer: MSKSEMI(美森科); Convert to PCB: yes; UniqueId: gge33ebbc6fa40b7b0c; ModelTransform: 104.3305,51.181,0,0,0,0,0,0,0; Device: B5817WS-MS; Supplier: LCSC; Supplier Part: C2836388; Manufacturer Part: B5817WS-MS; JLCPCB Part Class: Extended Part; Add into BOM: yes; SymbolName: B5817WS-MS; FootprintName: SOD-323_L1.7-W1.3-LS2.7-FD; OriginModelName: SOD-323_L1.7-W1.3-LS2.7-FD
D?#3 = SMF28CA: Manufacturer: AnBon(安邦); Convert to PCB: yes; UniqueId: gge8336ca0810bb463b; ModelTransform: 145.669,70.866,0,0,0,0,0,0,0; Device: SMF28CA; Supplier: LCSC; Supplier Part: C435496; Manufacturer Part: SMF28CA; JLCPCB Part Class: Extended Part; link: https://so.szlcsc.com/global.html?k=C435496&ref=editor; Add into BOM: yes; SymbolName: SMF28CA; FootprintName: SOD-123_L2.7-W1.8-LS3.7-BI; OriginModelName: SOD-123_L2.7-W1.8-LS3.7-BI
H?#1 = HDR-F-2.54_1x4: Convert to PCB: no; UniqueId: gge885eefff489981f5; Device: HDR-F-2.54_1x4; Supplier Part: C225501; Supplier: LCSC; Add into BOM: no; Origin Footprint: HDR-F-2.54_1X4; SymbolName: HDR-F-2.54_1x4
H?#2 = HDR-F-2.54_1x4: Convert to PCB: no; UniqueId: ggeb577fd7058a0a445; Device: HDR-F-2.54_1x4; Supplier Part: C225501; Supplier: LCSC; Add into BOM: no; Origin Footprint: HDR-F-2.54_1X4; SymbolName: HDR-F-2.54_1x4
H?#3 = HDR-F-2.54_1x4: Convert to PCB: no; UniqueId: ggeb2604217fb50aa1f; Device: HDR-F-2.54_1x4; Supplier Part: C225501; Supplier: LCSC; Add into BOM: no; Origin Footprint: HDR-F-2.54_1X4; SymbolName: HDR-F-2.54_1x4
H?#4 = HDR-F-2.54_1x4: Convert to PCB: no; UniqueId: ggee6be973db10bda17; Device: HDR-F-2.54_1x4; Supplier Part: C225501; Supplier: LCSC; Add into BOM: no; Origin Footprint: HDR-F-2.54_1X4; SymbolName: HDR-F-2.54_1x4
H?#5 = HDR-F-2.54_1x3: Convert to PCB: no; UniqueId: ggeb90c589a3958aeec; Device: HDR-F-2.54_1x3; Supplier Part: C146690; Supplier: LCSC; Add into BOM: no; Origin Footprint: HDR-F-2.54_1X3; SymbolName: HDR-F-2.54_1x3
J?#1 = HDR-M-2.54_1x2: Convert to PCB: no; UniqueId: gge45273bc977e0dc7f; Device: HDR-M-2.54_1x2; Supplier Part: C124375; Supplier: LCSC; Add into BOM: no; Origin Footprint: HDR-M-2.54_1X2; SymbolName: HDR-M-2.54_1x2
J?#2 = HDR-M-2.54_1x2: Convert to PCB: no; UniqueId: gge12fcbeb4db2ab241; Device: HDR-M-2.54_1x2; Supplier Part: C124375; Supplier: LCSC; Add into BOM: no; Origin Footprint: HDR-M-2.54_1X2; SymbolName: HDR-M-2.54_1x2
J?#3 = HDR-M-2.54_1x2: Convert to PCB: no; UniqueId: gge368a583462a7af64; Device: HDR-M-2.54_1x2; Supplier Part: C124375; Supplier: LCSC; Add into BOM: no; Origin Footprint: HDR-M-2.54_1X2; SymbolName: HDR-M-2.54_1x2
J?#4 = HDR-M-2.54_1x2: Convert to PCB: no; UniqueId: gge86939b4fd004270e; Device: HDR-M-2.54_1x2; Supplier Part: C124375; Supplier: LCSC; Add into BOM: no; Origin Footprint: HDR-M-2.54_1X2; SymbolName: HDR-M-2.54_1x2
J?#5 = HDR-M-2.54_1x2: Convert to PCB: no; UniqueId: gge963c905d1ba80b10; Device: HDR-M-2.54_1x2; Supplier Part: C124375; Supplier: LCSC; Add into BOM: no; Origin Footprint: HDR-M-2.54_1X2; SymbolName: HDR-M-2.54_1x2
L?#1 = PHC0420-100M-T: Manufacturer: EMTEK; Convert to PCB: yes; UniqueId: gge99af4ca34bfde78c; OriginModelName: IND-SMD_L4.4-W4.0-H1.2_PHC0420; ModelTransform: 175.1965,159.842,0,0,0,0,0,0,0; Device: PHC0420-100M-T; Supplier: LCSC; Supplier Part: C251694; Manufacturer Part: PHC0420-100M-T; Add into BOM: yes; SymbolName: 10uH; FootprintName: IND-SMD_L4.4-W4.0_PHC0420
L?#2 = PHC0420-100M-T: Manufacturer: EMTEK; Convert to PCB: yes; UniqueId: gge7b26eb143931701e; OriginModelName: IND-SMD_L4.4-W4.0-H1.2_PHC0420; ModelTransform: 175.1965,159.842,0,0,0,0,0,0,0; Device: PHC0420-100M-T; Supplier: LCSC; Supplier Part: C251694; Manufacturer Part: PHC0420-100M-T; Add into BOM: yes; SymbolName: 10uH; FootprintName: IND-SMD_L4.4-W4.0_PHC0420
LED?#1 = 19-217/GHC-YR1S2/3T: Manufacturer: EVERLIGHT(台湾亿光); Convert to PCB: yes; UniqueId: ggec33a0d43bf0fd1a5; OriginModelName: LED0603-RD_GREEN; ModelTransform: 63.7794,31.496,0,0,0,0,0,0,0; Device: 19-217/GHC-YR1S2/3T; Manufacturer Part: 19-217/GHC-YR1S2/3T; Supplier Part: C72043; Supplier: LCSC; Add into BOM: yes; SymbolName: LED-0603_G; FootprintName: LED0603_GREEN
LED?#2 = 19-217/BHC-ZL1M2RY/3T: Manufacturer: EVERLIGHT(台湾亿光); Convert to PCB: yes; UniqueId: gge88f0d97242bbc373; ModelTransform: 63.07074,31.57474,0,180,0,0,0,0,0; Device: 19-217/BHC-ZL1M2RY/3T; Manufacturer Part: 19-217/BHC-ZL1M2RY/3T; Supplier Part: C72041; Supplier: LCSC; Add into BOM: yes; SymbolName: LED-0603_B; FootprintName: LED0603_BLUE; OriginModelName: LED0603_BLUE
Q?#1 = S8050LT1-J3Y: Manufacturer: FH(风华); Convert to PCB: yes; UniqueId: gge1c8eb3e3ebf663b6; OriginModelName: SOT-23-3P_L2.9-W1.3-H1.0-LS2.4-P0.95; ModelTransform: 98.64468,114.173,0,180,0,0,0.001,0.001,0; Device: S8050LT1-J3Y; Supplier: LCSC; Supplier Part: C2962087; Manufacturer Part: S8050LT1-J3Y; link: https://atta.szlcsc.com/upload/public/pdf/source/20220411/740B3F4857AB400E9826209E74F1EDA4.pdf; Add into BOM: yes; SymbolName: S8050LT1-J3Y; FootprintName: SOT-23_L2.9-W1.3-P1.90-LS2.4-BR
Q?#2 = S8050LT1-J3Y: Manufacturer: FH(风华); Convert to PCB: yes; UniqueId: gge7f16b287a280f568; OriginModelName: SOT-23-3P_L2.9-W1.3-H1.0-LS2.4-P0.95; ModelTransform: 98.64468,114.173,0,180,0,0,0.001,0.001,0; Device: S8050LT1-J3Y; Supplier: LCSC; Supplier Part: C2962087; Manufacturer Part: S8050LT1-J3Y; link: https://atta.szlcsc.com/upload/public/pdf/source/20220411/740B3F4857AB400E9826209E74F1EDA4.pdf; Add into BOM: yes; SymbolName: S8050LT1-J3Y; FootprintName: SOT-23_L2.9-W1.3-P1.90-LS2.4-BR
R?#1 = 20R: Convert to PCB: yes; UniqueId: gge2803cdfef027f426; ModelTransform: 31.8897,63.7794,0,90,0,0,0,0,0; Device: 20R; Add into BOM: yes; SymbolName: 20R; FootprintName: R0603; OriginModelName: R0603
R?#2 = 20R: Convert to PCB: yes; UniqueId: ggeae51583009f5c62d; ModelTransform: 31.8897,63.7794,0,90,0,0,0,0,0; Device: 20R; Add into BOM: yes; SymbolName: 20R; FootprintName: R0603; OriginModelName: R0603
R?#3 = 1M: Convert to PCB: yes; UniqueId: gge718708ee9e31e9c6; ModelTransform: 31.8897,63.7794,0,90,0,0,0,0,0; Device: 1M; Add into BOM: yes; SymbolName: 1M; FootprintName: R0603; OriginModelName: R0603
R?#4 = 1M: Convert to PCB: yes; UniqueId: ggee74e946aa43fe3b1; ModelTransform: 31.8897,63.7794,0,90,0,0,0,0,0; Device: 1M; Add into BOM: yes; SymbolName: 1M; FootprintName: R0603; OriginModelName: R0603
R?#5 = 22R: Convert to PCB: yes; UniqueId: gge1054e90f8c2270dd; ModelTransform: 31.8897,63.7794,0,90,0,0,0,0,0; Device: 22R; Add into BOM: yes; SymbolName: 22R; FootprintName: R0603; OriginModelName: R0603
R?#6 = 22R: Convert to PCB: yes; UniqueId: gge376c1236b153a772; ModelTransform: 31.8897,63.7794,0,90,0,0,0,0,0; Device: 22R; Add into BOM: yes; SymbolName: 22R; FootprintName: R0603; OriginModelName: R0603
R?#7 = 100k: Convert to PCB: yes; UniqueId: gge65a4b7670a104600; ModelTransform: 31.8897,63.7794,0,90,0,0,0,0,0; Device: 100k; Add into BOM: yes; SymbolName: 100k; FootprintName: R0603; OriginModelName: R0603
R?#8 = 51k: Convert to PCB: yes; UniqueId: gge9fd81eef2a8f7ffa; ModelTransform: 31.8897,63.7794,0,90,0,0,0,0,0; Device: 51k; Add into BOM: yes; SymbolName: 51k; FootprintName: R0603; OriginModelName: R0603
R?#9 = 41.2k: Convert to PCB: yes; UniqueId: gge9f85a8b729309dec; ModelTransform: 31.8897,63.7794,0,90,0,0,0,0,0; Device: 41.2k; Add into BOM: yes; SymbolName: 41.2k; FootprintName: R0603; OriginModelName: R0603
R?#10 = 100k: Convert to PCB: yes; UniqueId: gge19e236c747ebd94a; ModelTransform: 31.8897,63.7794,0,90,0,0,0,0,0; Device: 100k; Add into BOM: yes; SymbolName: 100k; FootprintName: R0603; OriginModelName: R0603
R?#11 = 51k: Convert to PCB: yes; UniqueId: gge0f1b7351eff14f5c; ModelTransform: 31.8897,63.7794,0,90,0,0,0,0,0; Device: 51k; Add into BOM: yes; SymbolName: 51k; FootprintName: R0603; OriginModelName: R0603
R?#12 = 41.2k: Convert to PCB: yes; UniqueId: ggeaf2d57fb3ee954de; ModelTransform: 31.8897,63.7794,0,90,0,0,0,0,0; Device: 41.2k; Add into BOM: yes; SymbolName: 41.2k; FootprintName: R0603; OriginModelName: R0603
R?#13 = 3.6k: Convert to PCB: yes; UniqueId: gge2804a892dc8b5d22; ModelTransform: 31.8897,63.7794,0,90,0,0,0,0,0; Device: 3.6k; Add into BOM: yes; SymbolName: 3.6k; FootprintName: R0603; OriginModelName: R0603
R?#14 = 7.68k: Convert to PCB: yes; UniqueId: gge438bc0fbe55c7c82; ModelTransform: 31.8897,63.7794,0,90,0,0,0,0,0; Device: 7.68k; Add into BOM: yes; SymbolName: 7.68k; FootprintName: R0603; OriginModelName: R0603
R?#15 = 10k: Convert to PCB: yes; UniqueId: ggeb37841dcc2a40db6; ModelTransform: 31.8897,63.7794,0,90,0,0,0,0,0; Device: 10k; Add into BOM: yes; SymbolName: 10k; FootprintName: R0603; OriginModelName: R0603
R?#16 = RC0402FR-0710KL: Manufacturer: YAGEO(国巨); Convert to PCB: yes; UniqueId: gge03b7dc052d3712c7; OriginModelName: R0402_L1.0-W0.5-H0.4; ModelTransform: 39.37,19.685,0,0,0,0,0,0.001,0; Device: RC0402FR-0710KL; Supplier: LCSC; Manufacturer Part: RC0402FR-0710KL; Supplier Part: C60490; JLCPCB Part Class: Extended Part; Add into BOM: yes; SymbolName: 10kΩ; FootprintName: R0402
R?#17 = RC0402FR-0710KL: Manufacturer: YAGEO(国巨); Convert to PCB: yes; UniqueId: gge0e8147650a4c1f88; OriginModelName: R0402_L1.0-W0.5-H0.4; ModelTransform: 39.37,19.685,0,0,0,0,0,0.001,0; Device: RC0402FR-0710KL; Supplier: LCSC; Manufacturer Part: RC0402FR-0710KL; Supplier Part: C60490; JLCPCB Part Class: Extended Part; Add into BOM: yes; SymbolName: 10kΩ; FootprintName: R0402
R?#18 = RC0402FR-0710KL: Manufacturer: YAGEO(国巨); Convert to PCB: yes; UniqueId: gge4607301ef64e3a36; OriginModelName: R0402_L1.0-W0.5-H0.4; ModelTransform: 39.37,19.685,0,0,0,0,0,0.001,0; Device: RC0402FR-0710KL; Supplier: LCSC; Manufacturer Part: RC0402FR-0710KL; Supplier Part: C60490; JLCPCB Part Class: Extended Part; Add into BOM: yes; SymbolName: 10kΩ; FootprintName: R0402
R?#19 = 1k: Convert to PCB: yes; UniqueId: gge14669116017803cb; ModelTransform: 31.8897,63.7794,0,90,0,0,0,0,0; Device: 1k; Add into BOM: yes; SymbolName: 1k; FootprintName: R0603; OriginModelName: R0603
R?#20 = RC0402FR-0710KL: Manufacturer: YAGEO(国巨); Convert to PCB: yes; UniqueId: ggeb12758e104cafe18; OriginModelName: R0402_L1.0-W0.5-H0.4; ModelTransform: 39.37,19.685,0,0,0,0,0,0.001,0; Device: RC0402FR-0710KL; Supplier: LCSC; Manufacturer Part: RC0402FR-0710KL; Supplier Part: C60490; JLCPCB Part Class: Extended Part; Add into BOM: yes; SymbolName: 10kΩ; FootprintName: R0402
R?#21 = 10k: Convert to PCB: yes; UniqueId: ggecda1f708b81c7ca6; ModelTransform: 31.8897,63.7794,0,90,0,0,0,0,0; Device: 10k; Add into BOM: yes; SymbolName: 10k; FootprintName: R0603; OriginModelName: R0603
R?#22 = RC0402FR-0710KL: Manufacturer: YAGEO(国巨); Convert to PCB: yes; UniqueId: ggefd6f330f786ae1bc; OriginModelName: R0402_L1.0-W0.5-H0.4; ModelTransform: 39.37,19.685,0,0,0,0,0,0.001,0; Device: RC0402FR-0710KL; Supplier: LCSC; Manufacturer Part: RC0402FR-0710KL; Supplier Part: C60490; JLCPCB Part Class: Extended Part; Add into BOM: yes; SymbolName: 10kΩ; FootprintName: R0402
R?#23 = 10k: Convert to PCB: yes; UniqueId: gge74c37a84cb754f85; ModelTransform: 31.8897,63.7794,0,90,0,0,0,0,0; Device: 10k; Add into BOM: yes; SymbolName: 10k; FootprintName: R0603; OriginModelName: R0603
R?#24 = 75R: Convert to PCB: yes; UniqueId: gge99ad03ce5fc1563c; ModelTransform: 31.8897,63.7794,0,90,0,0,0,0,0; Device: 75R; Add into BOM: yes; SymbolName: 75R; FootprintName: R0603; OriginModelName: R0603
R?#25 = 10k: Convert to PCB: yes; UniqueId: ggecccef22c02713413; ModelTransform: 31.8897,63.7794,0,90,0,0,0,0,0; Device: 10k; Add into BOM: yes; SymbolName: 10k; FootprintName: R0603; OriginModelName: R0603
R?#26 = 10k: Convert to PCB: yes; UniqueId: ggecb38663ade157f52; ModelTransform: 31.8897,63.7794,0,90,0,0,0,0,0; Device: 10k; Add into BOM: yes; SymbolName: 10k; FootprintName: R0603; OriginModelName: R0603
R?#27 = 75R: Convert to PCB: yes; UniqueId: gge175528db6f6a6a66; ModelTransform: 31.8897,63.7794,0,90,0,0,0,0,0; Device: 75R; Add into BOM: yes; SymbolName: 75R; FootprintName: R0603; OriginModelName: R0603
R?#28 = 10k: Convert to PCB: yes; UniqueId: ggee41f9b045fab3390; ModelTransform: 31.8897,63.7794,0,90,0,0,0,0,0; Device: 10k; Add into BOM: yes; SymbolName: 10k; FootprintName: R0603; OriginModelName: R0603
R?#29 = 4K7: Convert to PCB: yes; UniqueId: gge096ca4e081fb04e8; ModelTransform: 31.8897,63.7794,0,90,0,0,0,0,0; Device: 4K7; Add into BOM: yes; SymbolName: 4K7; FootprintName: R0603; OriginModelName: R0603
R?#30 = 4K7: Convert to PCB: yes; UniqueId: gge5e765753ece9e3c8; ModelTransform: 31.8897,63.7794,0,90,0,0,0,0,0; Device: 4K7; Add into BOM: yes; SymbolName: 4K7; FootprintName: R0603; OriginModelName: R0603
R?#31 = 1k: Convert to PCB: yes; UniqueId: ggee0760564004a1d0b; ModelTransform: 31.8897,63.7794,0,90,0,0,0,0,0; Device: 1k; Add into BOM: yes; SymbolName: 1k; FootprintName: R0603; OriginModelName: R0603
R?#32 = 1k: Convert to PCB: yes; UniqueId: ggebc1ed0bbe25fab2f; ModelTransform: 31.8897,63.7794,0,90,0,0,0,0,0; Device: 1k; Add into BOM: yes; SymbolName: 1k; FootprintName: R0603; OriginModelName: R0603
R?#33 = 1k: Convert to PCB: yes; UniqueId: ggee94924af568416b5; ModelTransform: 31.8897,63.7794,0,90,0,0,0,0,0; Device: 1k; Add into BOM: yes; SymbolName: 1k; FootprintName: R0603; OriginModelName: R0603
R?#34 = 4D02WGF1002TCE: Manufacturer: UNI-ROYAL(厚声); Convert to PCB: yes; UniqueId: gge07544b47d1892801; OriginModelName: R0402-8P_L2.0-W1.0-H0.5; ModelTransform: 78.74,39.37,0,180,0,0,0,0,0; Device: 4D02WGF1002TCE; Supplier: LCSC; Supplier Part: C414600; Manufacturer Part: 4D02WGF1002TCE; Add into BOM: yes; SymbolName: 100*4; FootprintName: RES-ARRAY-SMD_0402-8P-L2.0-W1.0-BL
R?#35 = 4D02WGF1002TCE: Manufacturer: UNI-ROYAL(厚声); Convert to PCB: yes; UniqueId: gge77dae21efa63f364; OriginModelName: R0402-8P_L2.0-W1.0-H0.5; ModelTransform: 78.74,39.37,0,180,0,0,0,0,0; Device: 4D02WGF1002TCE; Supplier: LCSC; Supplier Part: C414600; Manufacturer Part: 4D02WGF1002TCE; Add into BOM: yes; SymbolName: 100*4; FootprintName: RES-ARRAY-SMD_0402-8P-L2.0-W1.0-BL
R?#36 = 1k: Convert to PCB: yes; UniqueId: ggec1dfd3b01c2c65db; ModelTransform: 31.8897,63.7794,0,90,0,0,0,0,0; Device: 1k; Add into BOM: yes; SymbolName: 1k; FootprintName: R0603; OriginModelName: R0603
SDO? = BMI270: Convert to PCB: yes; UniqueId: ggebe24d6cd85f7bebd; OriginModelName: LGA-14_L2.5-W3.0-H0.9-P0.50; ModelTransform: 118.11,98.425,0,0,0,0,0,0.001,0; Device: BMI270; Supplier: InvenSense; link: https://3cfeqx1hf82y3xcoull08ihx-wpengine.netdna-ssl.com/wp-content/uploads/2020/09/DS-000347-ICM-42688-P-v1.3.pdf; Add into BOM: yes; SymbolName: BMI270; FootprintName: LGA-14_L3.0-W2.5-P0.50-TL
SW? = TS-1073B-A2B2-D4: Manufacturer: Yuandi(元迪); Convert to PCB: yes; UniqueId: gge673417370de76ff0; ModelTransform: 188.976,137.795,0,0,0,0,0.66,24.554,-15.748; Device: TS-1073B-A2B2-D4; Supplier: LCSC; Supplier Part: C492942; Manufacturer Part: TS-1073B-A2B2-D4; JLCPCB Part Class: Extended Part; link: https://so.szlcsc.com/global.html?k=C492942&ref=editor; Add into BOM: yes; SymbolName: TS-1073B-A2B2-D4; FootprintName: KEY-SMD_TS-1073B-A2B2-D4; OriginModelName: KEY-SMD_TS-1073B-A2B2-D4
U?#1 = SPX3819M5-L-3-3/TR: Manufacturer: MaxLinear(迈凌); Convert to PCB: yes; UniqueId: gge70c12bce5ebcd7d5; OriginModelName: SOT-23-5_L2.9-W1.6-H1.1-LS2.8-P0.95; ModelTransform: 114.173,109.636,0,180,0,0,0,-0.001,0; Device: SPX3819M5-L-3-3/TR; Supplier: LCSC; Manufacturer Part: SPX3819M5-L-3-3/TR; Supplier Part: C9055; JLCPCB Part Class: Extended Part; Add into BOM: yes; SymbolName: SPX3819M5-L-3-3/TR; FootprintName: SOT-23-5_L3.0-W1.7-P0.95-LS2.8-BL
U?#2 = MP9943: Convert to PCB: yes; UniqueId: ggeb87cc7bca5c8949e; Device: MP9943; Add into BOM: yes; SymbolName: MP9943; FootprintName: QFN-8-3X3
U?#3 = MP9943: Convert to PCB: yes; UniqueId: gge5de058e1dcebc45f; Device: MP9943; Add into BOM: yes; SymbolName: MP9943; FootprintName: QFN-8-3X3
U?#4 = SPX3819M5-L-3-3/TR: Manufacturer: MaxLinear(迈凌); Convert to PCB: yes; UniqueId: ggead5155cd06fa3072; OriginModelName: SOT-23-5_L2.9-W1.6-H1.1-LS2.8-P0.95; ModelTransform: 114.173,109.636,0,180,0,0,0,-0.001,0; Device: SPX3819M5-L-3-3/TR; Supplier: LCSC; Manufacturer Part: SPX3819M5-L-3-3/TR; Supplier Part: C9055; JLCPCB Part Class: Extended Part; Add into BOM: yes; SymbolName: SPX3819M5-L-3-3/TR; FootprintName: SOT-23-5_L3.0-W1.7-P0.95-LS2.8-BL
U?#5 = 8M/3213: Convert to PCB: yes; UniqueId: ggee29a88e2d2ac9ac9; ModelTransform: 125.984,51.181,0,0,0,0,-0.592,-0.591,0; Device: 8M/3213; Add into BOM: yes; SymbolName: 8M/3213; FootprintName: X3213; OriginModelName: X3213
U?#6 = MPU-6500: Manufacturer: TDK InvenSense(应美盛); Convert to PCB: yes; UniqueId: gge6fb0faa0bb8ee760; OriginModelName: QFN-24_L3.0-W3.0-H0.9-P0.40-BL-EP; ModelTransform: 118.11,118.11,0,90,0,0,0,0,0; Device: MPU-6500; Supplier: LCSC; Manufacturer Part: MPU-6500; Supplier Part: C50278; JLCPCB Part Class: Extended Part; Add into BOM: yes; SymbolName: MPU6500; FootprintName: QFN-24_L3.0-W3.0-P0.40-BL-EP
U?#7 = AT32F435VMT7: Manufacturer: ARTERY（雅特力）; Convert to PCB: yes; UniqueId: ggece277d5420079038; OriginModelName: LQFP-100_L14.0-W14.0-H1.4-LS16.0-P0.50; ModelTransform: 629.921,629.921,0,270,0,0,0,0,0; Device: AT32F435VMT7; Supplier: LCSC; Supplier Part: C3029578; Manufacturer Part: AT32F435VMT7; link: https://atta.szlcsc.com/upload/public/pdf/source/20220608/9A6D4578C11CEA8ECA586071DFEBC06A.pdf; Add into BOM: yes; SymbolName: AT32F437VMT7-LQFP100; FootprintName: LQFP-100_L14.0-W14.0-P0.50-LS16.0-TL
U?#8 = BMP280: Manufacturer: Bosch; Convert to PCB: yes; UniqueId: gge447de30e0e3d1cf2; OriginModelName: LGA-8_L2.0-W2.5-H1.0-P0.65; ModelTransform: 98.425,78.74,0,270,0,0,0.005,-0.001,0; Device: BMP280; Supplier: LCSC; Manufacturer Part: BMP280; Supplier Part: C83291; JLCPCB Part Class: Extended Part; Add into BOM: yes; SymbolName: BMP280; FootprintName: SENSOR-TH_BMP280-BL
U?#9 = 2016晶振/27M: Convert to PCB: yes; UniqueId: gge8a1c1357ed2894bc; OriginModelName: OSC-SMD_4P-L2.0-W1.6-H0.8; ModelTransform: 78.74,62.992,0,0,0,0,0,0,0; Device: 2016晶振/27M; Add into BOM: yes; SymbolName: 2016晶振/27M; FootprintName: 2016晶振
U?#10 = AT7456E: Manufacturer: ZHONGKEWEI; Convert to PCB: yes; UniqueId: gge0ef7d474198b7014; ModelTransform: 381.889,251.968,0,0,0,0,0,0.005,0; Device: AT7456E; Supplier: LCSC; Manufacturer Part: AT7456E; Supplier Part: C82351; JLCPCB Part Class: Extended Part; Add into BOM: yes; SymbolName: AT7456E; FootprintName: TSSOP-28_L9.7-W4.4-P0.65-LS6.4-BL-EP5.5; OriginModelName: TSSOP-28_L9.7-W4.4-P0.65-LS6.4-BL-EP5.5
U?#11 = ZX-SH1.0-10PWT: Manufacturer: Megastar(兆星); Convert to PCB: yes; UniqueId: gge7200404e0632cc6f; ModelTransform: 486.613,198.8185,0,0,0,0,-0.001,-6.062,0; Device: ZX-SH1.0-10PWT; Supplier: LCSC; Supplier Part: C19272377; Manufacturer Part: ZX-SH1.0-10PWT; Add into BOM: yes; SymbolName: ZX-SH1.0-10PWT; FootprintName: CONN-SMD_10P-P1.00_ZX-SH1.0-10PWT; OriginModelName: CONN-SMD_10P-P1.00_ZX-SH1.0-10PWT
U?#12 = W25N01GVZEIG: Manufacturer: Winbond Elec; Convert to PCB: yes; UniqueId: ggee63176ef5aab684c; OriginModelName: WSON-8_L8.0-W6.0-H0.8-P1.27; ModelTransform: 315.7474,236.22,0,0,0,0,0,0,0; Device: W25N01GVZEIG; Supplier: LCSC; Supplier Part: C88868; Manufacturer Part: W25N01GVZEIG; JLCPCB Part Class: Extended Part; Add into BOM: yes; SymbolName: W25N01GVZEIG; FootprintName: WSON-8_L8.0-W6.10-P1.27-EP
USB? = TYPEC-304A-ACP16L: Manufacturer: XUNPU(讯普); Convert to PCB: yes; UniqueId: gge27292bd05ad1f100; ModelTransform: 351.9678,298.4246,0,180,0,0,0,-45.275,-39.37; Device: TYPEC-304A-ACP16L; Supplier: LCSC; Supplier Part: C2909609; Manufacturer Part: TYPEC-304A-ACP16L; JLCPCB Part Class: Extended Part; Add into BOM: yes; SymbolName: TYPEC-304A-16L; FootprintName: USB-C-SMD_XUNPU_TYPEC-304A-ACP16L; OriginModelName: USB-C-SMD_XUNPU_TYPEC-304A-ACP16L